# EasyEDA Pro project scd30_easyeda_pro.epro

# Schematic env_esphome_reorder_capacitor
Board Name: env_esphome_reorder_capacitor; Create Date: 2025-01-01; Page Name: with_scd30_with_pins_uart; Project Name: scd_with_pins_uart; Schematic Name: env_esphome_reorder_capacitor; Update Date: 2025-01-02; Add into BOM: yes; Company: lrlunin; Convert to PCB: yes; Date: 2024-12-10; Draw By: Leonid Lunin; REV: 1.0; Sheet: 1/1
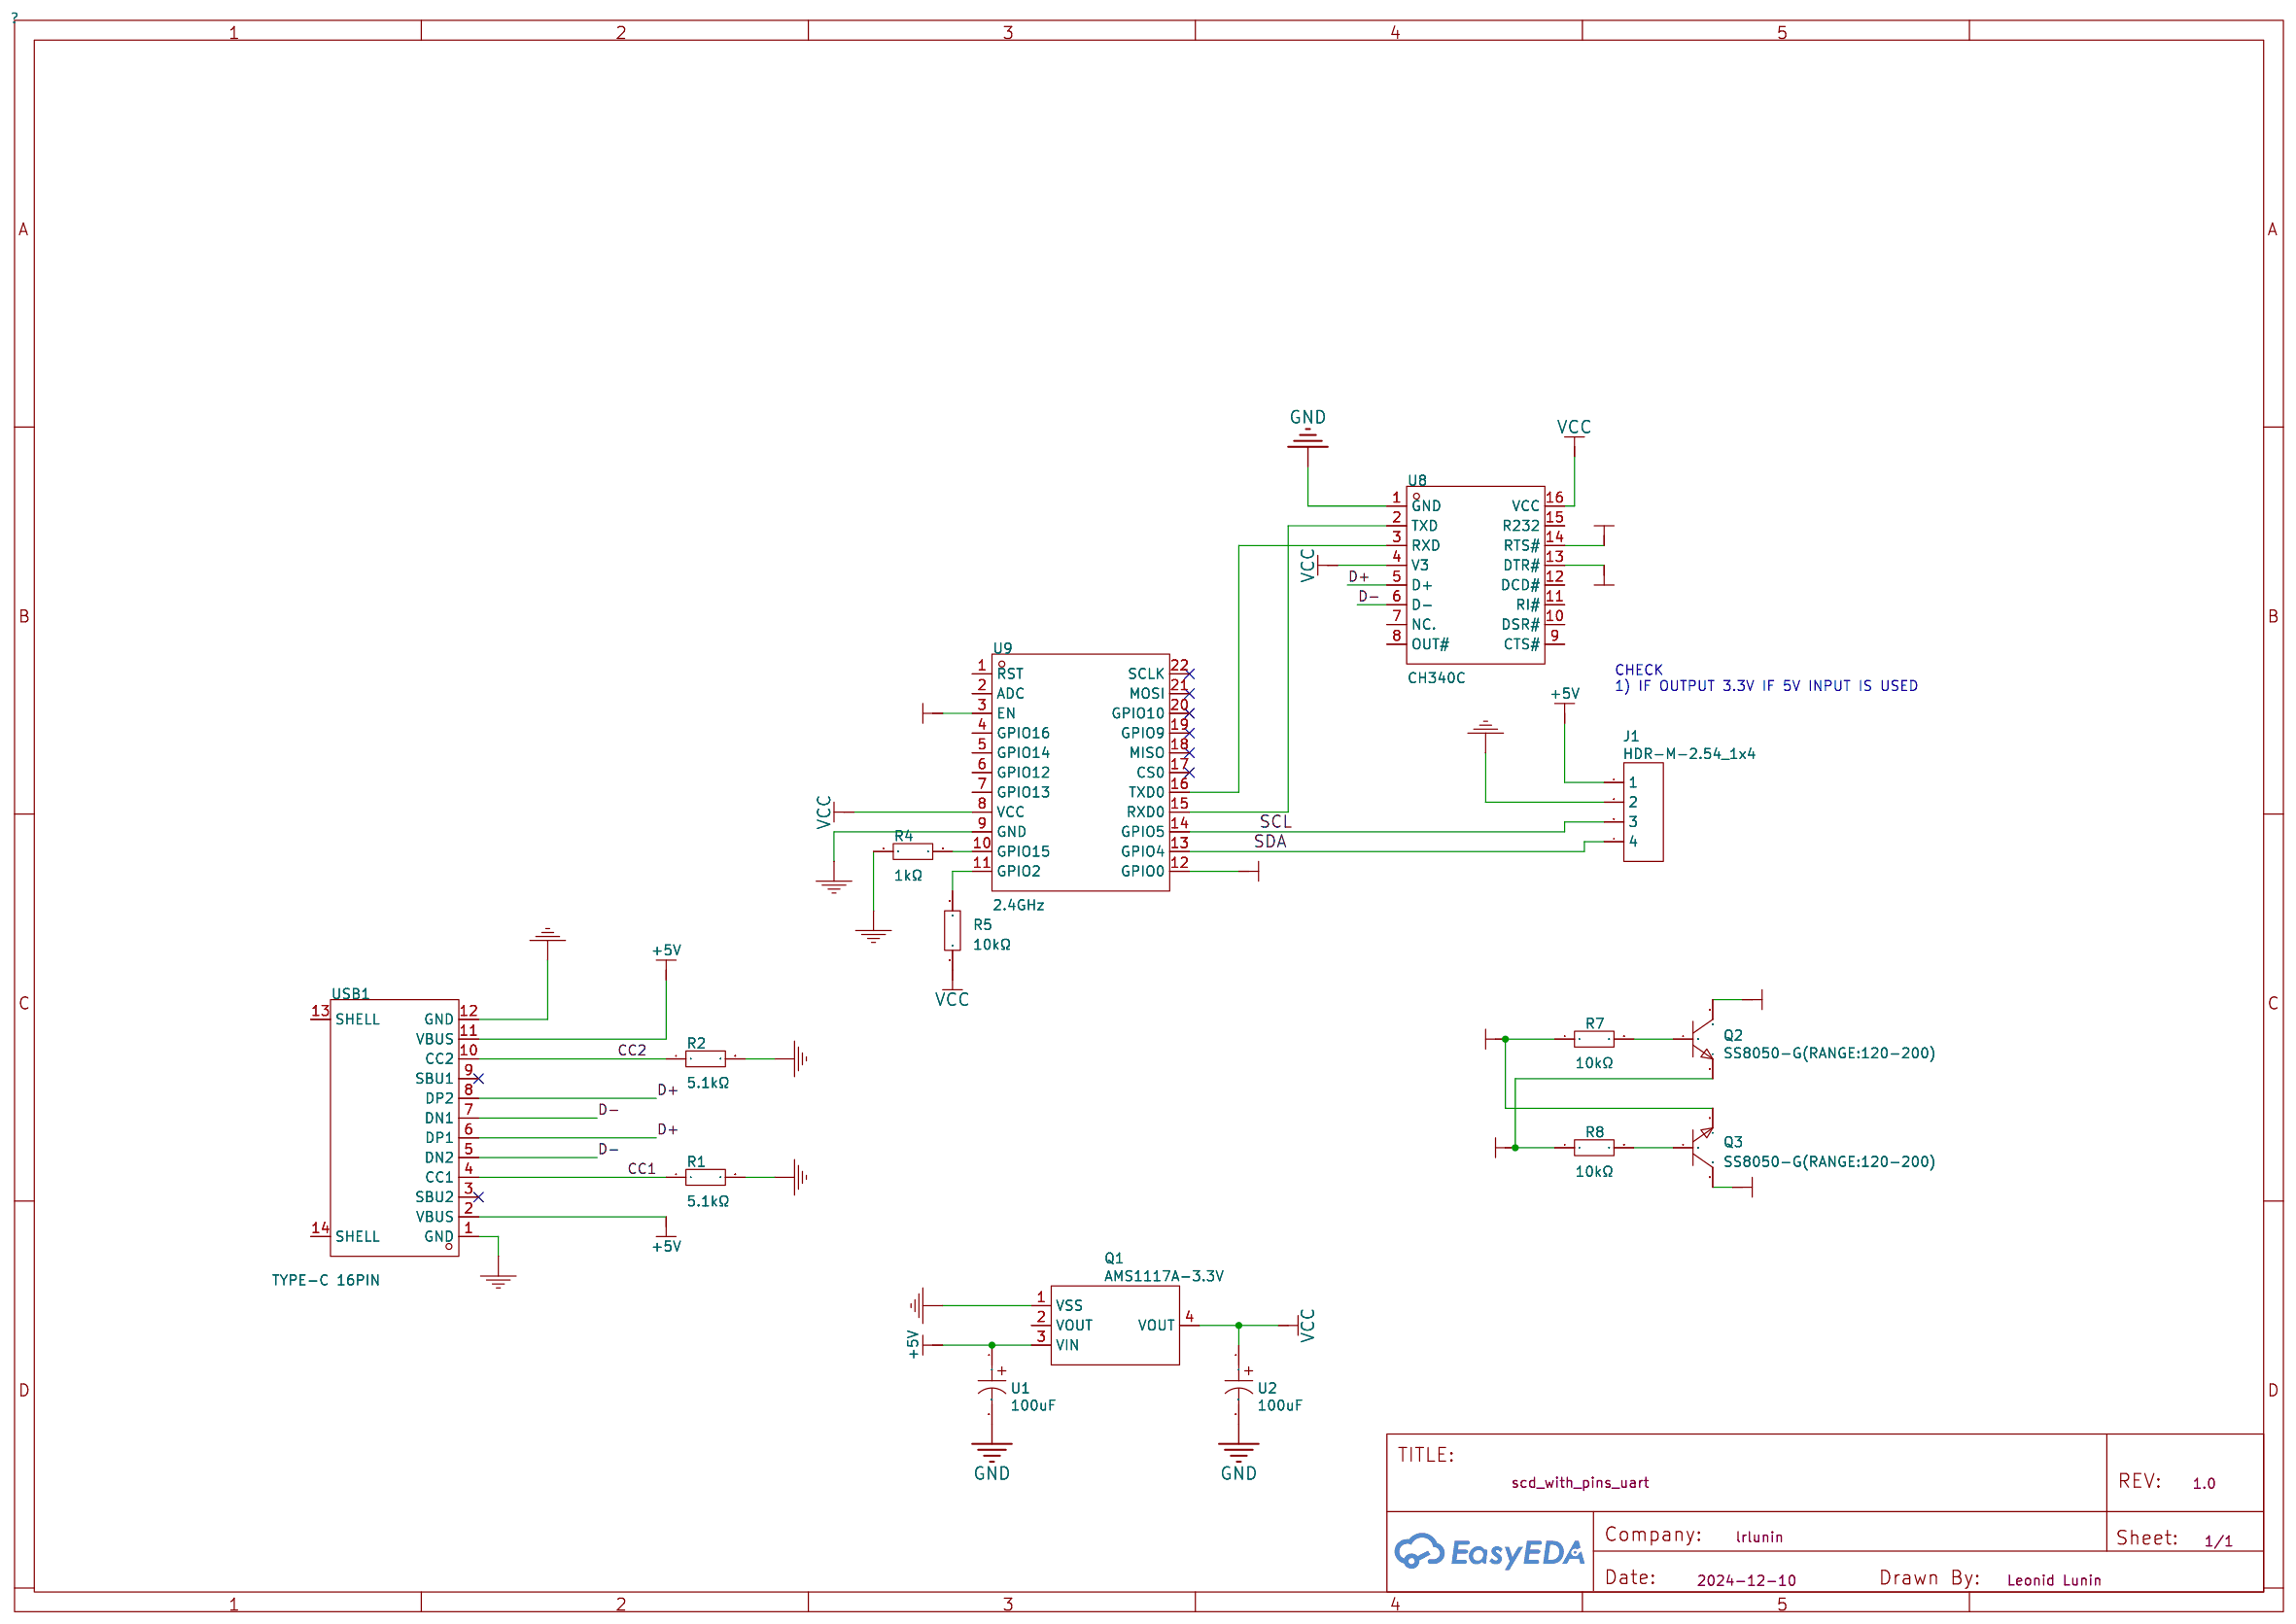
[diagram p0: schematic sheet]

## Parts
J1  HDR-M-2.54_1x4  [HDR-M-2.54_1X4]
Q1  AMS1117A-3.3V  [SOT-223_L6.3-W3.5-P2.30-LS7.0-BR]
Q2  SS8050-G(RANGE:120-200)  [SOT-23-3_L2.9-W1.3-P1.90-LS2.4-BR]
Q3  SS8050-G(RANGE:120-200)  [SOT-23-3_L2.9-W1.3-P1.90-LS2.4-BR]
R1  5.1kΩ  [R0402]
R2  5.1kΩ  [R0402]
R4  1kΩ  [R0402]
R5  10kΩ  [R0402]
R7  10kΩ  [R0402]
R8  10kΩ  [R0402]
U1  100uF  [CAP-SMD_BD6.3-L6.6-W6.6-LS7.2-FD]
U2  100uF  [CAP-SMD_BD6.3-L6.6-W6.6-LS7.2-FD]
U8  CH340C  [SOP-16_L10.0-W3.9-P1.27-LS6.0-BL]
U9  2.4GHz  [WIFIM-SMD_ESP-12F-ESP8266MOD]
USB1  TYPE-C 16PIN  [USB-C-SMD_TYPE-C-6PIN-2MD-073]

## Library data of the parts
J1 = HDR-M-2.54_1x4: Supplier Part: C124378; Supplier: LCSC
Q1 = AMS1117A-3.3V: Supplier: LCSC; Supplier Part: C2984862; Manufacturer: HX(恒佳兴); JLCPCB Part Class: Extended Part; link: https://atta.szlcsc.com/upload/public/pdf/source/20220408/BD3226BAC8A4B812F5CB2AD559ECEC03.pdf
Q2 Q3 = SS8050-G(RANGE:120-200): Transistor Type: Collector Current (Ic): Collector-Emitter Breakdown Voltage (Vceo): Power Dissipation (Pd): DC Current Gain (hFE@Ic,Vce):120@100mA,1V DC Current Gain (hFE@Ic,Vce):120@100mA,1V Transition Frequency (fT):100MHz Collector Cut-Off Current (Ic; LCSC Part Name: NPN 电流:1.5A 耐压:25V L档(120-200); Supplier Part: C164886; Manufacturer: CJ(江苏长电/长晶); Supplier Footprint: SOT-23; JLCPCB Part Class: Extended Part; Datasheet: https://atta.szlcsc.com/upload/public/pdf/source/20180130/C177739_15172974524031323483.pdf; Supplier: LCSC; DC Current Gain (hFE@Ic,Vce): 120@100mA,1V; Transition Frequency (fT): 100MHz; Collector Cut-Off Current (Icbo): 100nA; Collector-Emitter Saturation Voltage (VCE(sat)@Ic,Ib): 500mV@800mA,80mA; Operating Temperature: -55℃~+150℃
R1 R2 = RC0402FR-075K1L: Type:Thick Film Resistors Resistance: Tolerance:±1% Tolerance:±1% Power(Watts): Overload Voltage (Max): Temperature Coefficient:±100ppm/℃ Temperature Coefficient:±100ppm/℃ Operating Temperature Range:-55℃~+155℃ Operating Temperature Range:-55℃~+155℃; LCSC Part Name: 厚膜电阻 5.1kΩ ±1% 62.5mW; Supplier Part: C105872; Manufacturer: YAGEO(国巨); Supplier Footprint: 0402; JLCPCB Part Class: Extended Part; Datasheet: https://atta.szlcsc.com/upload/public/pdf/source/20180821/C275644_0D56F95EFF785E7D9A1FEF436B37DA78.pdf; Supplier: LCSC; Type: Thick Film Resistors; Tolerance: ±1%; Temperature Coefficient: ±100ppm/℃; Operating Temperature Range: -55℃~+155℃
R4 = RC0402FR-071KL: Type:Thick Film Resistors Resistance: Tolerance:±1% Tolerance:±1% Power(Watts): Overload Voltage (Max): Temperature Coefficient:±100ppm/℃ Temperature Coefficient:±100ppm/℃ Operating Temperature Range:-55℃~+155℃ Operating Temperature Range:-55℃~+155℃; LCSC Part Name: 厚膜电阻 1kΩ ±1% 62.5mW; Supplier Part: C106235; Manufacturer: YAGEO(国巨); Supplier Footprint: 0402; JLCPCB Part Class: Extended Part; Datasheet: https://atta.szlcsc.com/upload/public/pdf/source/20180927/C295883_E8D83085EA81BD7DE0B2B681138C15EE.pdf; Supplier: LCSC; Type: Thick Film Resistors; Tolerance: ±1%; Temperature Coefficient: ±100ppm/℃; Operating Temperature Range: -55℃~+155℃
R5 R7 R8 = RC0402FR-0710KL: Type:Thick Film Resistors Resistance: Tolerance:±1% Tolerance:±1% Power(Watts): Overload Voltage (Max): Temperature Coefficient:±100ppm/℃ Temperature Coefficient:±100ppm/℃ Operating Temperature Range:-55℃~+155℃ Operating Temperature Range:-55℃~+155℃; LCSC Part Name: 厚膜电阻 10kΩ ±1% 62.5mW; Supplier Part: C60490; Manufacturer: YAGEO(国巨); Supplier Footprint: 0402; JLCPCB Part Class: Extended Part; Datasheet: https://atta.szlcsc.com/upload/public/pdf/source/20170925/C131467_1506321478108990263.pdf; Supplier: LCSC; Type: Thick Film Resistors; Tolerance: ±1%; Temperature Coefficient: ±100ppm/℃; Operating Temperature Range: -55℃~+155℃
U1 U2 = 100uF: Supplier: LCSC; Supplier Part: C5199087; Manufacturer: CapXon(丰宾); JLCPCB Part Class: Extended Part
U8 = CH340C: Applications Function:Transceiver Protocol: Supply Voltage:3.3V；5V Supply Voltage:3.3V；5V Data Rate:2Mbps; LCSC Part Name: CH340C USB转串口芯片 CH340; Supplier Part: C84681; Manufacturer: WCH(南京沁恒); Supplier Footprint: SOP-16; JLCPCB Part Class: Extended Part; Datasheet: https://atta.szlcsc.com/upload/public/pdf/source/20240619/63986D8440D4E5267A77ACD891CC4DE3.pdf; Supplier: LCSC; Applications Function: Transceiver; Supply Voltage: 3.3V；5V; Data Rate: 2Mbps
U9 = ESP-12F(ESP8266MOD): Core Processor:ESP8266 chip Wireless Standard:- Support Interface:GPIO；UART；I2C；PWM；SPI；ADC Frequency:2.4GHz Antenna Type:On-board PCB antenna Output Power:16dBm Output Power:16dBm Operating Voltage:3.3V Operating Voltage:3.3V Receive  Current:120mA Send; LCSC Part Name: 完整的802.11b/g/nWi-FiSoC模块 屏蔽罩上的丝印是：ESP8266MOD，ESP8266EX串口WIFI; Supplier Part: C82891; Manufacturer: Ai-Thinker(安信可); Supplier Footprint: SMD,16x24mm; JLCPCB Part Class: Extended Part; Datasheet: https://atta.szlcsc.com/upload/public/pdf/source/20210219/C82891_ABD84A460F4F056A2757267CCCA4B508.pdf; Supplier: LCSC; Core Processor: ESP8266 chip; Support Interface: GPIO；UART；I2C；PWM；SPI；ADC; Antenna Type: On-board PCB antenna; Output Power: 16dBm; Operating Voltage: 3.3V; Receive  Current: 120mA; Send  Current: 170mA; Sensitivity: -90dBm; Operating Temperature: -40℃~+85℃
USB1 = TYPE-C 16PIN 2MD(073): Connector Type:Type-C Standard:USB 3.1 Gender:Female Mounting Style:Horizontal attachment Number of Contacts:16P Number of Ports:1 Current Rating - Power (Max):5A Operating Temperature Range:-25℃~+85℃ Operating Temperature Range:-25℃~+85℃ Rated Voltage (M; LCSC Part Name: Type-C 母 卧贴; Supplier Part: C2765186; Manufacturer: SHOU HAN(首韩); Supplier Footprint: SMD; JLCPCB Part Class: Extended Part; Datasheet: https://atta.szlcsc.com/upload/public/pdf/source/20211123/39B17C16241EAC15C5E277BDA434118E.pdf; Supplier: LCSC; Connector Type: Type-C; Standard: USB 3.1; Gender: Female; Mounting Style: Horizontal attachment; Number of Contacts: 16P; Number of Ports: 1; Current Rating - Power (Max): 5A; Operating Temperature Range: -25℃~+85℃; Rated Voltage (Max): 5V; Connect-Disconnect Life: 5000 Cuts; Core Colour: Black

## Nets
+5V: J1.1 Q1.3(VIN) U1.1 USB1.2(VBUS) USB1.11(VBUS)
GND: J1.2 Q1.1(VSS) R1.2 R2.2 R4.1 U1.2 U2.2 U8.1(GND) U9.9(GND) USB1.1(GND) USB1.12(GND)
VCC: Q1.4(VOUT) R5.1 U2.1 U8.4(V3) U8.16(VCC) U9.8(VCC)
CC1: R1.1 USB1.4(CC1)
CC2: R2.1 USB1.10(CC2)
D+: U8.5(D+) USB1.6(DP1) USB1.8(DP2)
D-: U8.6(D-) USB1.5(DN2) USB1.7(DN1)
DTR: Q3.2(E) R7.1 U8.13(DTR#)
EN: Q2.3(C) U9.3(EN)
IO0: Q3.3(C) U9.12(GPIO0)
RTS: Q2.2(E) R8.1 U8.14(RTS#)
SCL: J1.3 U9.14(GPIO5)
SDA: J1.4 U9.13(GPIO4)
$1N9: R4.2 U9.10(GPIO15)
$1N3422: U8.2(TXD) U9.15(RXD0)
$1N5192: R5.2 U9.11(GPIO2)
$1N5198: U8.3(RXD) U9.16(TXD0)
$1N5996: Q2.1(B) R7.2
$1N6000: Q3.1(B) R8.2

Not connected (* = marked no-connect by the designer): Q1 2(VOUT); U8 7(NC.) 8(OUT#) 9(CTS#) 10(DSR#) 11(RI#) 12(DCD#) 15(R232); U9 1(RST) 2(ADC) 4(GPIO16) 5(GPIO14) 6(GPIO12) 7(GPIO13) 17(CS0)* 18(MISO)* 19(GPIO9)* 20(GPIO10)* 21(MOSI)* 22(SCLK)*; USB1 3(SBU2)* 9(SBU1)* 13(SHELL) 14(SHELL)

## Notes on the sheet
- CHECK
  1) IF OUTPUT 3.3V IF 5V INPUT IS USED

# Board 1-PCB_env_esphome_reorder_capacitor
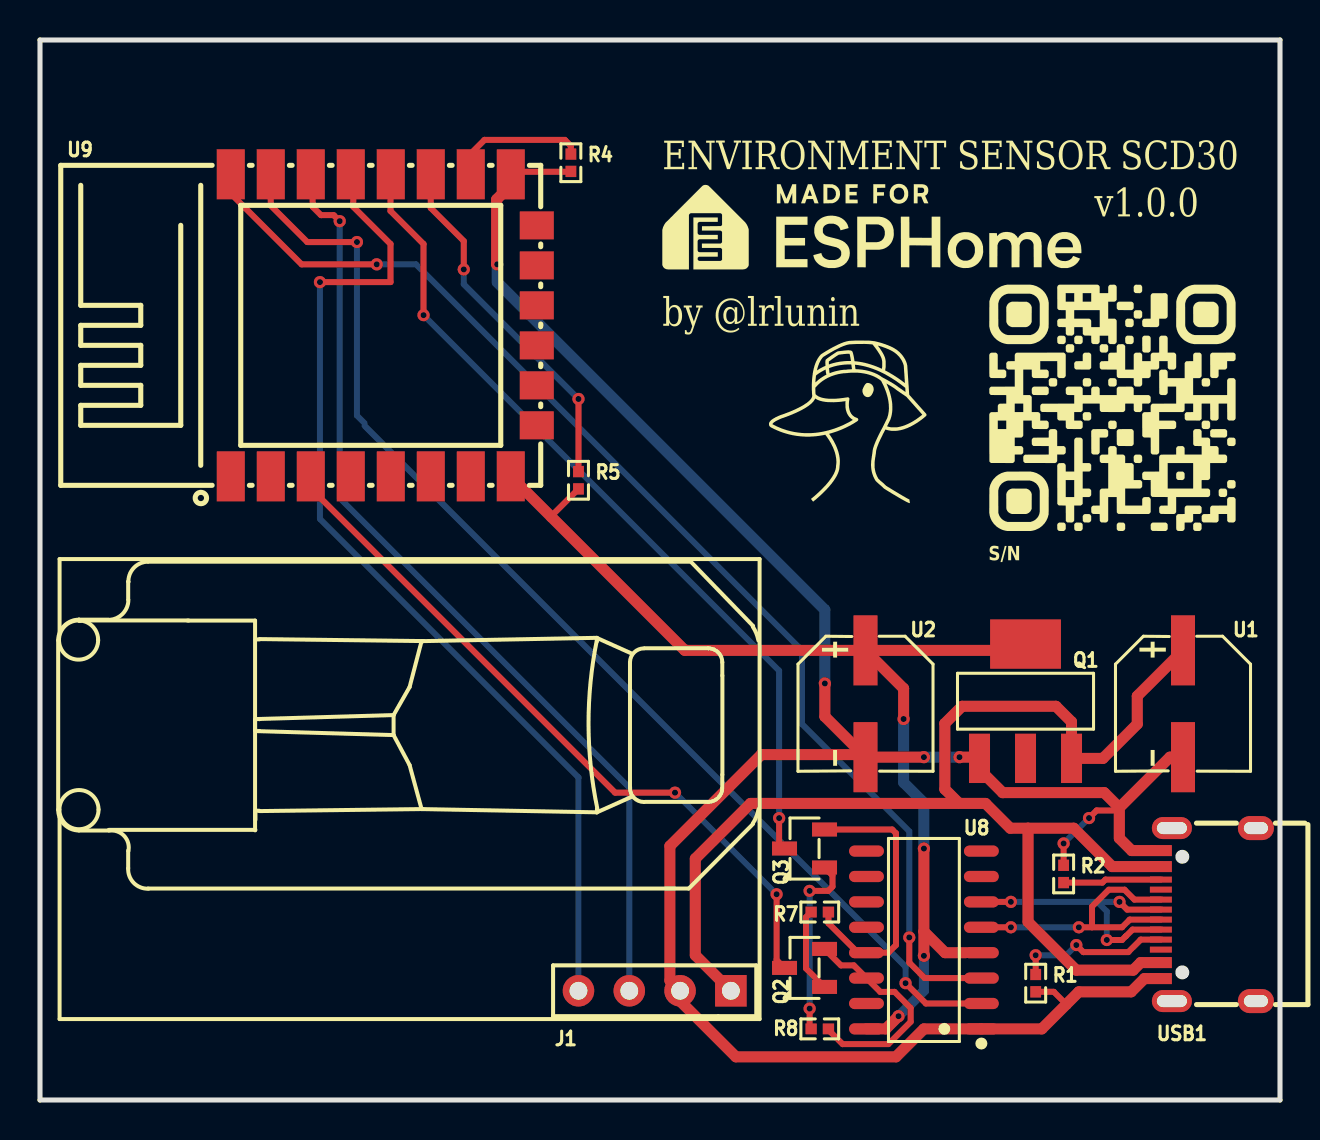
[diagram p1: board, top side]
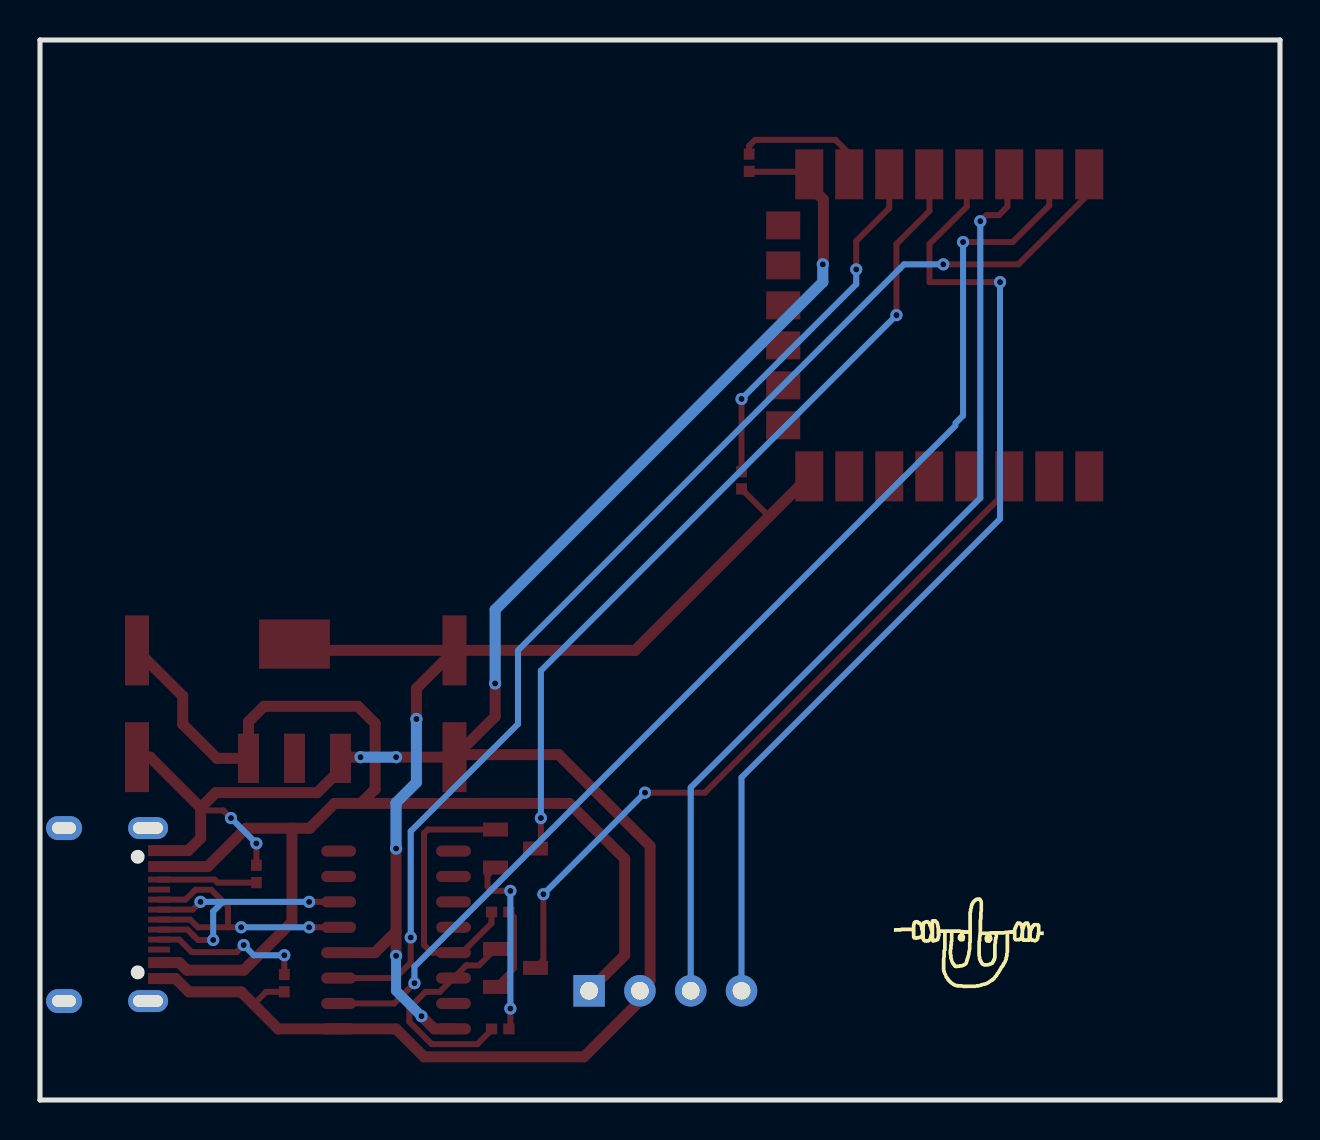
[diagram p2: board, bottom side, seen from below]

Outline 62 x 53 mm; copper layers: Top Layer, Bottom Layer. Coordinates in mm from the lower left corner of the outline.
Outline path: 0,53 62,53 62,0 0,0 0,53
Stack: Top Layer 0.035mm / Dielectric1 1.51mm FR4 er 4.5 / Bottom Layer 0.035mm

## Design rules (mm)
net D+: DP1
net D-: DP1
template: JLCPCB Capability(Two Layers Board)
spacing copperThickness1oz (default): track to track 0.102, other pairs 0.152 to 0.3
spacing copperThickness2oz: track to track 0.203, other pairs 0.152 to 0.3
track width copperThickness1oz (default): min 0.127, default 0.254, max 2.54
track width copperThickness2oz: min 0.203, default 0.254, max 2.54
differential pair differentialPair (default): width min 0.127, default 0.254, max 2.54; gap min 0.152, default 0.152
via viaSize (default): diameter min 0.5, default 0.61, max 10; hole min 0.3, default 0.305, max 6.3

## Placement (name value [footprint] x y rotation side)
J1  HDR-M-2.54_1x4  [HDR-M-2.54_1X4]  30.73 5.46 180 top
Q1  AMS1117A-3.3V  [SOT-223_L6.3-W3.5-P2.30-LS7.0-BR]  49.28 19.94 90 top
Q2  SS8050-G(RANGE:120-200)  [SOT-23-3_L2.9-W1.3-P1.90-LS2.4-BR]  38.23 6.6 0 top
Q3  SS8050-G(RANGE:120-200)  [SOT-23-3_L2.9-W1.3-P1.90-LS2.4-BR]  38.23 12.57 0 top
R1  5.1kΩ  [R0402]  49.78 5.84 270 top
R2  5.1kΩ  [R0402]  51.18 11.3 90 top
R4  1kΩ  [R0402]  26.54 46.86 90 top
R5  10kΩ  [R0402]  26.92 30.99 90 top
R7  10kΩ  [R0402]  38.99 9.4 180 top
R8  10kΩ  [R0402]  38.99 3.56 180 top
U1  100uF  [CAP-SMD_BD6.3-L6.6-W6.6-LS7.2-FD]  57.15 19.81 270 top
U2  100uF  [CAP-SMD_BD6.3-L6.6-W6.6-LS7.2-FD]  41.28 19.81 270 top
U8  CH340C  [SOP-16_L10.0-W3.9-P1.27-LS6.0-BL]  44.2 8 90 top
U9  2.4GHz  [WIFIM-SMD_ESP-12F-ESP8266MOD]  17.19 38.73 0 top
USB1  TYPE-C 16PIN  [USB-C-SMD_TYPE-C-6PIN-2MD-073]  58.42 9.27 90 top

## Footprints (pads in the part's own frame, mm; a bottom-side part is the same pattern mirrored in y, then rotated)
CAP-SMD_BD6.3-L6.6-W6.6-LS7.2-FD
  rect 3.5x1.2 smd: 1(-2.67,0) 2(2.67,0)
HDR-M-2.54_1X4
  rect 1.575x1.575 hole 0.889: 1(-3.81,0)
  round 1.575 hole 0.889: 2(-1.27,0) 3(1.27,0) 4(3.81,0)
R0402
  rect 0.566x0.54 smd: 1(-0.433,0) 2(0.433,0)
SOP-16_L10.0-W3.9-P1.27-LS6.0-BL
  oval 0.56x1.745 smd: 1(-4.445,-2.873) 2(-3.175,-2.873) 3(-1.905,-2.873) 4(-0.635,-2.873) 5(0.635,-2.873) 6(1.905,-2.873) 7(3.175,-2.873) 8(4.445,-2.873) 9(4.445,2.873) 10(3.175,2.873) 11(1.905,2.873) 12(0.635,2.873) 13(-0.635,2.873) 14(-1.905,2.873) 15(-3.175,2.873) 16(-4.445,2.873)
SOT-23-3_L2.9-W1.3-P1.90-LS2.4-BR
  rect 1.25x0.7 smd: 1(1,-0.95) 2(1,0.95) 3(-1,0)
SOT-223_L6.3-W3.5-P2.30-LS7.0-BR
  rect 2.465x1.05 smd: 1(-2.857,2.3) 2(-2.857,0) 3(-2.857,-2.3)
  rect 2.465x3.54 smd: 4(2.857,0)
USB-C-SMD_TYPE-C-6PIN-2MD-073
  rect 0.55x1.1 smd: 1(-3.2,2.375) 2(-2.4,2.375) 11(2.4,2.375) 12(3.2,2.375)
  rect 0.3x1.1 smd: 3(-1.75,2.375) 4(-1.25,2.375) 5(-0.75,2.375) 6(-0.25,2.375) 7(0.25,2.375) 8(0.75,2.375) 9(1.25,2.375) 10(1.75,2.375)
  oval 1.1x2 hole 0.6x1.5: 13(-4.325,1.825) 14(4.325,1.825)
  oval 1.2x1.8 hole 0.6x1.2: 13(-4.325,-2.375) 14(4.325,-2.375)
WIFIM-SMD_ESP-12F-ESP8266MOD
  rect 1.4x2.5 smd: 1(-7.651,-7.551) 2(-5.651,-7.551) 3(-3.651,-7.551) 4(-1.651,-7.551) 5(0.349,-7.551) 6(2.349,-7.551) 7(4.349,-7.551) 8(6.349,-7.551) 9(6.349,7.548) 10(4.349,7.55) 11(2.349,7.551) 12(0.349,7.551) 13(-1.651,7.55) 14(-3.651,7.551) 15(-5.651,7.551) 16(-7.651,7.551)
  rect 1.7x1.4 smd: 17(7.651,-5) 18(7.649,-3.002) 19(7.649,-1.004) 20(7.649,0.998) 21(7.649,2.997) 22(7.651,4.997)

## Nets
As in the schematic.

Pads without a net: Q1 2; U8 7 8 9 10 11 12 15; U9 1 2 4 5 6 7 17 18 19 20 21 22; USB1 3 9 13 14

## Via types
v1: diameter 0.61, hole 0.305, Top Layer to Bottom Layer, 31 vias

## Routing (per net, layer and track width the routed paths; a pad name or vN(x,y) marks a point on that pad's centre or on a via; arc(x,y) is an arc through that point)
+5V: length 67.3
  Top Layer w0.55: USB1.2 55.03,6.87 54.65,6.49 51.82,6.49 49.4,8.9 49.4,13.59 ; 49.4,13.59 51.69,13.59 53.61,11.67 USB1.11 ; 49.4,13.59 48.51,13.59 47.27,14.83 35.53,14.83 32.77,12.06 32.77,7.24 J1.1 ; U1.1 54.86,20.2 54.86,18.8 53.15,17.08 Q1.3 51.58,18.91 50.8,19.69 46.1,19.69 45.24,18.83 45.24,15.54 45.92,14.86
GND: length 112.3
  Top Layer w0.3: 51.32,4.78 50.69,5.41 R1.2 ; 23.66,46.41 26.52,46.41 ; R2.2 v1(51.18,12.83) ; v1(52.45,14.1) 52.83,14.48 53.83,14.48
  Top Layer w0.55: USB1.1 55.22,6.07 54.56,5.41 51.94,5.41 50.09,3.56 U8.1 44.2,3.56 42.8,2.16 34.8,2.16 32,4.95 J1.2 31.5,5.97 31.5,12.7 36.06,17.27 41.15,17.27 39.24,19.17 v1(39.24,20.83) ; U1.2 56.5,17.14 53.97,14.61 ; U2.2 v1(44.2,17.14) ; 23.11,45.31 22.83,45.02 22.83,41.81 v1(22.86,41.78) ; 53.97,14.61 53.21,15.37 48.13,15.37 46.98,16.52 ; 53.97,14.61 53.97,13.09 54.59,12.47 55.66,12.47 ; v1(45.97,17.14) 46.92,17.14
  Bottom Layer w0.3: v1(51.18,12.83) v1(52.45,14.1)
  Bottom Layer w0.55: v1(22.86,41.78) 22.86,40.89 39.24,24.51 v1(39.24,20.83) ; v1(44.2,17.14) v1(45.97,17.14)
VCC: length 55.4
  Top Layer w0.3: 25.58,29.14 25.58,29.21 26.92,30.56
  Top Layer w0.55: v1(44.2,7.21) 44.2,8.42 ; 44.2,8.42 v1(44.2,12.57) ; 44.2,8.42 45.25,7.37 46.31,7.37 ; U2.1 32.24,22.48 U9.8 ; U2.1 43.18,20.58 v1(43.18,19.05) ; U2.1 48.96,22.48 ; U8.16 42.29,3.56 v1(42.93,4.19)
  Bottom Layer w0.5: v1(42.93,4.19) 44.2,5.46 v1(44.2,7.21)
  Bottom Layer w0.55: v1(43.18,19.05) 43.18,15.88 44.2,14.86 v1(44.2,12.57)
CC1: length 7.8
  Top Layer w0.3: R1.1 v1(49.78,7.24) ; v1(51.82,7.75) 52.17,7.39 54.41,7.39 55.04,8.02 USB1.4
  Bottom Layer w0.3: v1(49.78,7.24) 51.31,7.24 v1(51.82,7.75)
CC2: length 4.9
  Top Layer w0.3: USB1.10 53.27,11.02 53.12,10.87 R2.1
D+: length 14.2
  Top Layer w0.3: v1(51.94,8.64) 52.6,8.64 ; 52.6,8.64 54.1,8.64 54.49,9.02 USB1.6 ; 52.6,8.64 52.6,9.68 53.44,10.51 54.23,10.51 54.72,10.02 USB1.8 ; 48.53,8.64 U8.5
  Bottom Layer w0.3: 48.53,8.64 v1(51.94,8.64)
  vias: v1(48.54,8.64)
D-: length 14.2
  Top Layer w0.3: v1(53.97,9.91) 54.36,9.52 USB1.7 ; v1(48.54,9.91) U8.6 ; USB1.5 54.63,8.52 54.29,8.18 54.28,8.18 54.1,8 v1(53.34,8)
  Bottom Layer w0.3: 52.87,9.91 v1(53.97,9.91) ; 52.87,9.91 53.34,9.43 v1(53.34,8) ; 52.87,9.91 v1(48.54,9.91)
DTR: length 13.9
  Top Layer w0.3: R7.1 39.42,8.84 40.89,7.37 U8.13 42.42,7.37 42.8,7.75 42.8,13.33 42.61,13.52 Q3.2
EN: length 35
  Top Layer w0.3: Q2.3 36.83,7 v1(36.83,10.29) ; 13.96,30.16 28.76,15.37 v1(31.75,15.37)
  Bottom Layer w0.3: v1(36.83,10.29) v1(31.75,15.37)
IO0: length 41.9
  Top Layer w0.3: U9.12 17.53,46.27 17.53,44.45 19.18,42.8 v1(19.18,39.24) ; v1(36.96,14.1) 36.96,12.84 Q3.3
  Bottom Layer w0.3: v1(36.96,14.1) 36.96,21.46 v1(19.18,39.24)
RTS: length 11.2
  Top Layer w0.3: Q2.2 40.05,6.73 40.69,6.73 U8.14 42.01,5.41 42.72,5.41 43.53,4.6 43.53,3.91 42.42,2.79 40.13,2.79 39.37,3.56
SCL: length 47.8
  Top Layer w0.3: U9.14 13.63,46.19 13.63,44.66 14.05,44.24 14.69,44.24 v1(14.99,43.94)
  Bottom Layer w0.3: v1(14.99,43.94) 14.99,30.1 29.46,15.62 J1.3
SDA: length 50.5
  Top Layer w0.3: U9.13 15.66,46.16 15.66,44.66 17.53,42.8 17.53,40.89 v1(14,40.89)
  Bottom Layer w0.3: v1(14,40.89) 14,29.06 26.92,16.13 J1.4
$1N9: length 6.9
  Top Layer w0.3: R4.2 26.54,47.71 26.24,48.01 22.22,48.01 21.54,47.32 U9.10
$1N3422: length 59.1
  Top Layer w0.3: v1(43.28,5.84) 44.29,4.83 U8.2 ; U9.15 11.54,44.72 13.36,42.9 v1(15.85,42.9)
  Bottom Layer w0.3: v1(15.85,42.9) 15.85,34.22 16.23,33.84 ; 16.23,33.71 43.28,6.66 v1(43.28,5.84)
$1N5192: length 17.9
  Top Layer w0.3: v1(21.19,41.53) 21.19,42.95 19.54,44.6 U9.11 ; v1(26.92,35.05) R5.2
  Bottom Layer w0.3: v1(26.92,35.05) 21.19,40.79 v1(21.19,41.53)
$1N5198: length 60.7
  Top Layer w0.3: U8.3 44.24,6.1 43.46,6.87 v1(43.46,8.13) ; v1(16.84,41.78) 13.08,41.78 9.54,45.33 U9.16
  Bottom Layer w0.3: v1(43.46,8.13) 43.46,13.43 38.1,18.8 38.1,22.48 18.8,41.78 v1(16.84,41.78)
$1N5996: length 4.2
  Top Layer w0.3: Q2.1 38.3,6.58 38.3,9.14 R7.2
$1N6000: length 9.2
  Top Layer w0.3: 38.48,3.63 v1(38.48,4.57) ; v1(38.48,10.46) 39.41,10.46 39.62,10.67 39.62,11.23 39.23,11.62
  Bottom Layer w0.3: v1(38.48,4.57) v1(38.48,10.46)

## Text on the board
Top Silkscreen Layer: ENVIRONMENT SENSOR SCD30 | by @lrlunin | v1.0.0 | S/N
